# EAGLE design esquematico (EAGLE 9.5.2)
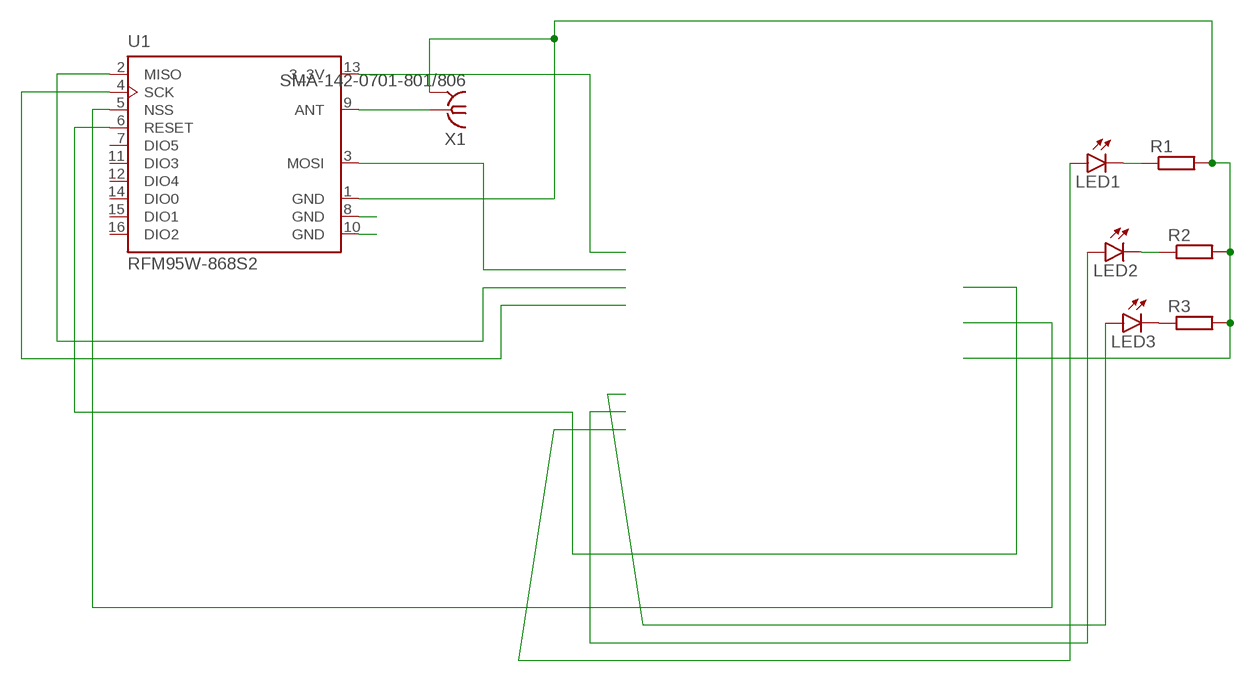
[diagram p0: schematic, sheet 1]

## Parts
LED1  LED3MM  [LED3MM]
LED2  LED3MM  [LED3MM]
LED3  LED3MM  [LED3MM]
R1  R-EU_M0805  [M0805]
R2  R-EU_M0805  [M0805]
R3  R-EU_M0805  [M0805]
U1  RFM95W-868S2  [XCVR_RFM95W-868S2]
X1  SMA-142-0701-801/806  [J502-ND-142-0701-801/806]

## Nets
A: U1.8(GND)
B: U1.10(GND)
N$1: U1.3(MOSI)
N$2: U1.2(MISO)
N$3: U1.4(SCK)
N$4: U1.9(ANT) X1.1
N$5: U1.5(NSS)
N$6: U1.6(RESET)
N$7: LED3.K(C) R3.1
N$8: LED2.K(C) R2.1
N$9: LED1.K(C) R1.1
N$10: LED3.A
N$11: LED2.A
N$12: LED1.A
N$13: U1.13(3_3V)
N$14: R1.2 R2.2 R3.2 U1.1(GND) X1.G@1 X1.G@2 X1.G@3 X1.G@4
Unconnected: U1.7(DIO5) U1.11(DIO3) U1.12(DIO4) U1.14(DIO0) U1.15(DIO1) U1.16(DIO2)

## Library data of the parts
LED1-LED3 = led:LED: LED OSRAM: - CHIPLED LG R971, LG N971, LY N971, LG Q971, LY Q971, LO R971, LY R971 LH N974, LH R974 LS Q976, LO Q976, LY Q976 LO Q996 - Hyper CHIPLED LW Q18S LB Q993, LB Q99A, LB R99A - SideLED LS A670, LO A670, LY A670, LG A670, LP A670 LB A673, LV A673, LT A673, LW A673 LH A674 LY A675 LS A676, LA A676, LO A676, LY A676, LW A676 LS A679, LY A679, LG A679 - Hyper Micro SIDELED® LS Y876, LA Y876, LO Y876, LY Y876 LT Y87S - SmartLED LW L88C, LW L88S LB L89C, LB L89S, LG L890 LS L89K, LO L89K, LY L89K LS L896, LA L896, LO L896, LY L896 - TOPLED LS T670, LO T670, LY T670, LG T670, LP T670 LSG T670, LSP T670, LSY T670, LOP T670, LYG T670 LG T671, LOG T671, LSG T671 LB T673, LV T673, LT T673, LW T673 LH T674 LS T676, LA T676, LO T676, LY T676, LB T676, LH T676, LSB T676, LW T676 LB T67C, LV T67C, LT T67C, LS T67K, LO T67K, LY T67K, LW E67C LS E67B, LA E67B, LO E67B, LY E67B, LB E67C, LV E67C, LT E67C LW T67C LS T679, LY T679, LG T679 LS T770, LO T770, LY T770, LG T770, LP T770 LB T773, LV T773, LT T773, LW T773 LH T774 LS E675, LA E675, LY E675, LS T675 LS T776, LA T776, LO T776, LY T776, LB T776 LHGB T686 LT T68C, LB T68C - Hyper Mini TOPLED® LB M676 - Mini TOPLED Santana® LG M470 LS M47K, LO M47K, LY M47K Source: http://www.osram.convergy.de LUXEON: - LUMILED® LXK2-PW12-R00, LXK2-PW12-S00, LXK2-PW14-U00, LXK2-PW14-V00 LXK2-PM12-R00, LXK2-PM12-S00, LXK2-PM14-U00 LXK2-PE12-Q00, LXK2-PE12-R00, LXK2-PE12-S00, LXK2-PE14-T00, LXK2-PE14-U00 LXK2-PB12-K00, LXK2-PB12-L00, LXK2-PB12-M00, LXK2-PB14-N00, LXK2-PB14-P00, LXK2-PB14-Q00 LXK2-PR12-L00, LXK2-PR12-M00, LXK2-PR14-Q00, LXK2-PR14-R00 LXK2-PD12-Q00, LXK2-PD12-R00, LXK2-PD12-S00 LXK2-PH12-R00, LXK2-PH12-S00 LXK2-PL12-P00, LXK2-PL12-Q00, LXK2-PL12-R00 Source: www.luxeon.com KINGBRIGHT: KA-3528ASYC Source: www.kingbright.com
R1-R3 = rcl:R-EU_: RESISTOR, European symbol; SPICEPREFIX: R
U1 = RFM95W-868S2:RFM95W-868S2: Mod Txrx Lora +20dbm 868mhz Smd Check prices <https://pricing.snapeda.com/parts/RFM95W-868S2/RF/view-part?ref=eda>; AVAILABILITY: Warning; DESCRIPTION: General ISM < 1GHz LoRa™ Transceiver Module 868MHz Antenna Not Included Surface Mount; MF: RF; MP: RFM95W-868S2; PACKAGE: SMD-16 Hope Microelectronics; PRICE: None; PURCHASE-URL: https://pricing.snapeda.com/search/part/RFM95W-868S2/?ref=eda
X1 = con-coax:SMA-: SMA 50 Ohm End Launch Jack Receptacle - Round Contact Johnson Components Source: www.johnsoncomponents.com .. J502-ND.pdf; MF: JOHNSON COMPONENTS; MPN: 142-0701-801; OC_FARNELL: 1608592; OC_NEWARK: 90F2624

## Board
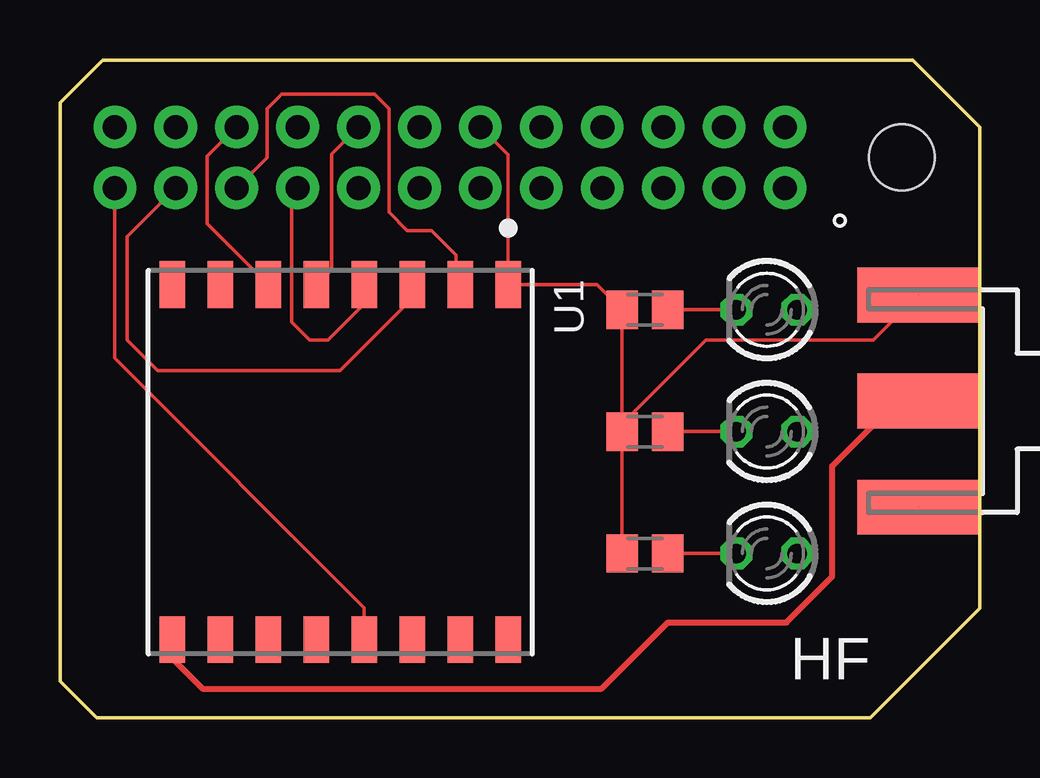
[diagram p1: board, top side]
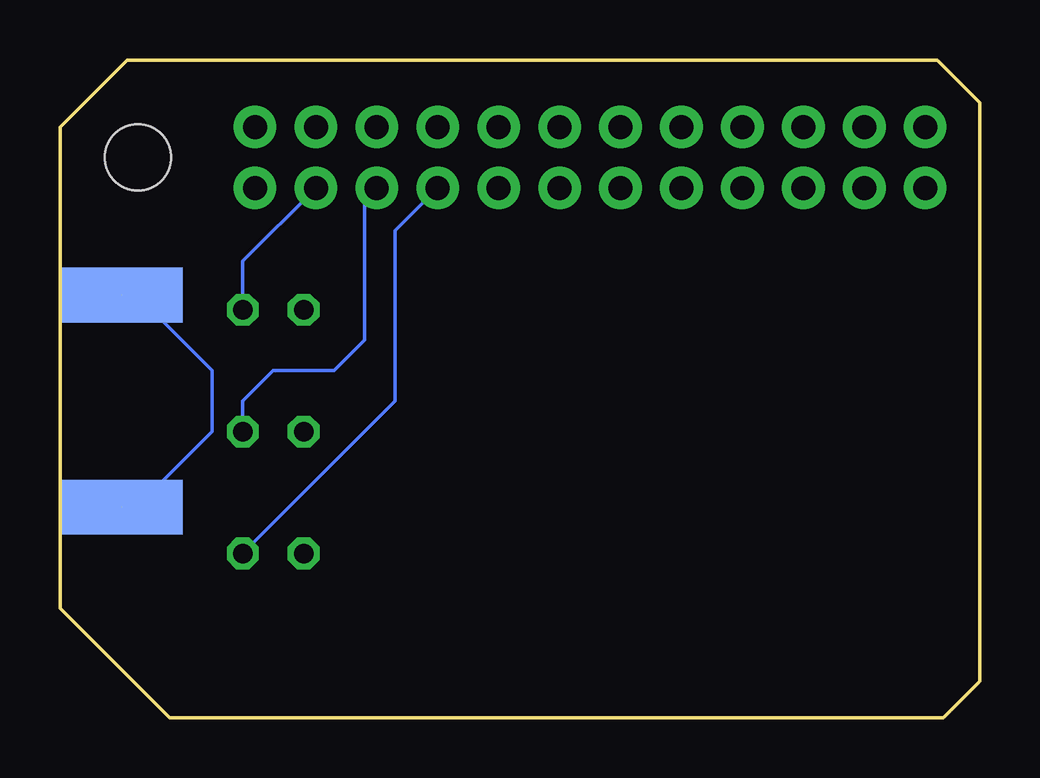
[diagram p2: board, bottom side, seen from below]

Size 38.35 x 27.43 mm. Coordinates in mm from the lower left corner, seen from the top.
Outline: 1.52,0 0,1.52 0,25.65 1.78,27.43 35.56,27.43 38.35,24.64 38.35,4.57 33.78,0 1.52,0
Copper layers (1*16): Top 0.035mm / dielectric 1.5mm / Bottom 0.035mm
Design rules "default": minimum track width 6mil, minimum drill 0.35mm, track to track 6mil, track to pad 6mil, pad to pad 6mil, via to via 6mil, smd to smd 6mil, copper to edge 40mil, drill to drill 6mil, minimum pad ring 10mil, minimum via ring 8mil, stop-mask expansion 4mil, vias tented up to drill 0mil, thermal gap 10mil
Holes 2.75 mm at 35.1,23.37

### Footprints (pad centres in the part's own frame; a part is rotated, then mirrored left to right if it is on the bottom)
LED3MM = drill 0.813 octagon: A -1.27,0; K 1.27,0
M0805 = smd 1.3 x 1.6: 1 -0.95,0; 2 0.95,0
XCVR_RFM95W-868S2 = smd 1.95 x 1.05: 1 -7.4,7; 2 -7.4,5; 3 -7.4,3; 4 -7.4,1; 5 -7.4,-1; 6 -7.4,-3; 7 -7.4,-5; 8 -7.4,-7; 9 7.4,-7; 10 7.4,-5; 11 7.4,-3; 12 7.4,-1; 13 7.4,1; 14 7.4,3; 15 7.4,5; 16 7.4,7
J502-ND-142-0701-801/806 = smd 5.08 x 2.286: 1 2.565,0; G@1 2.565,4.42; G@2 2.565,-4.42 | smd 5.08 x 2.286 bottom: G@3 2.565,4.42; G@4 2.565,-4.42

### Placement (x,y rotation side)
LED1  29.46,17.02 180 top
LED2  29.46,11.94 180 top
LED3  29.46,6.86 180 top
R1  24.38,17.02 180 top
R2  24.38,11.94 180 top
R3  24.38,6.86 180 top
U1  11.68,10.67 270 top
X1  38.35,13.21 180 top

### Tracks (layer width: path | path; a pad name or v marks a point on that pad's centre or on a via)
N$1  (via drill 1 pad 1.78)
  Top 0.152: U1.3 14.68,17.48 11.68,14.48 4.06,14.48 2.79,15.75 2.79,19.81 2.79,19.91 2.79,20.07 v4.83,22.1
N$2  (via drill 1 pad 1.78)
  Top 0.152: U1.2 16.51,18.24 16.51,19.3 15.49,20.32 14.48,20.32 13.72,21.08 13.72,25.4 13.11,26.01 9.25,26.01 8.64,25.4 8.64,23.37 v7.37,22.1
N$3  (via drill 1 pad 1.78)
  Top 0.152: U1.4 12.68,17.26 11.18,15.75 10.41,15.75 9.65,16.51 9.65,21.84 v9.91,22.1
N$4
  Top 0.254: U1.9 4.68,2.47 5.94,1.22 22.58,1.22 25.35,3.98 30.28,3.98 32.2,5.89 32.2,10.5 34.91,13.21 X1.1
N$5  (via drill 1 pad 1.78)
  Top 0.152: U1.5 11.32,18.7 11.32,23.51 v12.45,24.64
N$6  (via drill 1 pad 1.78)
  Top 0.152: U1.6 6.14,20.61 6.14,23.42 v7.37,24.64
N$7
  Top 0.152: LED3.K R3.1
N$8
  Top 0.152: LED2.K R2.1
N$9
  Top 0.152: LED1.K R1.1
N$10  (via drill 1 pad 1.78)
  Bottom 0.152: LED3.A 24.38,13.21 24.38,20.32 v22.61,22.1
N$11  (via drill 1 pad 1.78)
  Bottom 0.152: LED2.A 30.73,13.21 29.46,14.48 26.92,14.48 25.65,15.75 25.65,21.59 v25.15,22.1
N$12  (via drill 1 pad 1.78)
  Bottom 0.152: v27.69,22.1 30.73,19.05 LED1.A
N$13  (via drill 1 pad 1.78)
  Top 0.152: U1.13 12.68,4.59 2.27,15 2.27,22.09 v2.29,22.1
N$14  (via drill 1 pad 1.78)  (2 unrouted)
  Top 0.152: R2.2 R3.2 23.43,6.54 | R2.2 R1.2 22.38,18.07 U1.1 18.68,23.48 v17.53,24.64 | X1.G@4 33.91,15.75 26.92,15.75 23.43,12.26 R2.2
  Bottom 0.152: X1.G@3 35.15,8.79 32,11.94 32,14.48 35.15,17.63 X1.G@4
N$16  (via drill 1 pad 1.78)
  other vias: 2.29,24.64
N$17  (via drill 1 pad 1.78)
  other vias: 30.23,22.1
N$18  (via drill 1 pad 1.78)
  other vias: 4.83,24.64
N$22  (via drill 1 pad 1.78)
  other vias: 9.91,24.64
N$25  (via drill 1 pad 1.78)
  other vias: 12.45,22.1
N$26  (via drill 1 pad 1.78)
  other vias: 14.99,24.64
N$27  (via drill 1 pad 1.78)
  other vias: 14.99,22.1
N$29  (via drill 1 pad 1.78)
  other vias: 17.53,22.1
N$30  (via drill 1 pad 1.78)
  other vias: 20.07,24.64
N$31  (via drill 1 pad 1.78)
  other vias: 20.07,22.1
N$32  (via drill 1 pad 1.78)
  other vias: 22.61,24.64
N$35  (via drill 1 pad 1.78)
  other vias: 25.15,24.64
N$36  (via drill 1 pad 1.78)
  other vias: 27.69,24.64
N$38  (via drill 1 pad 1.78)
  other vias: 30.23,24.64

### Text on the board
tNames: HF